# EAGLE design ESP32_Thing_Plus_UFL (EAGLE 9.6.2)
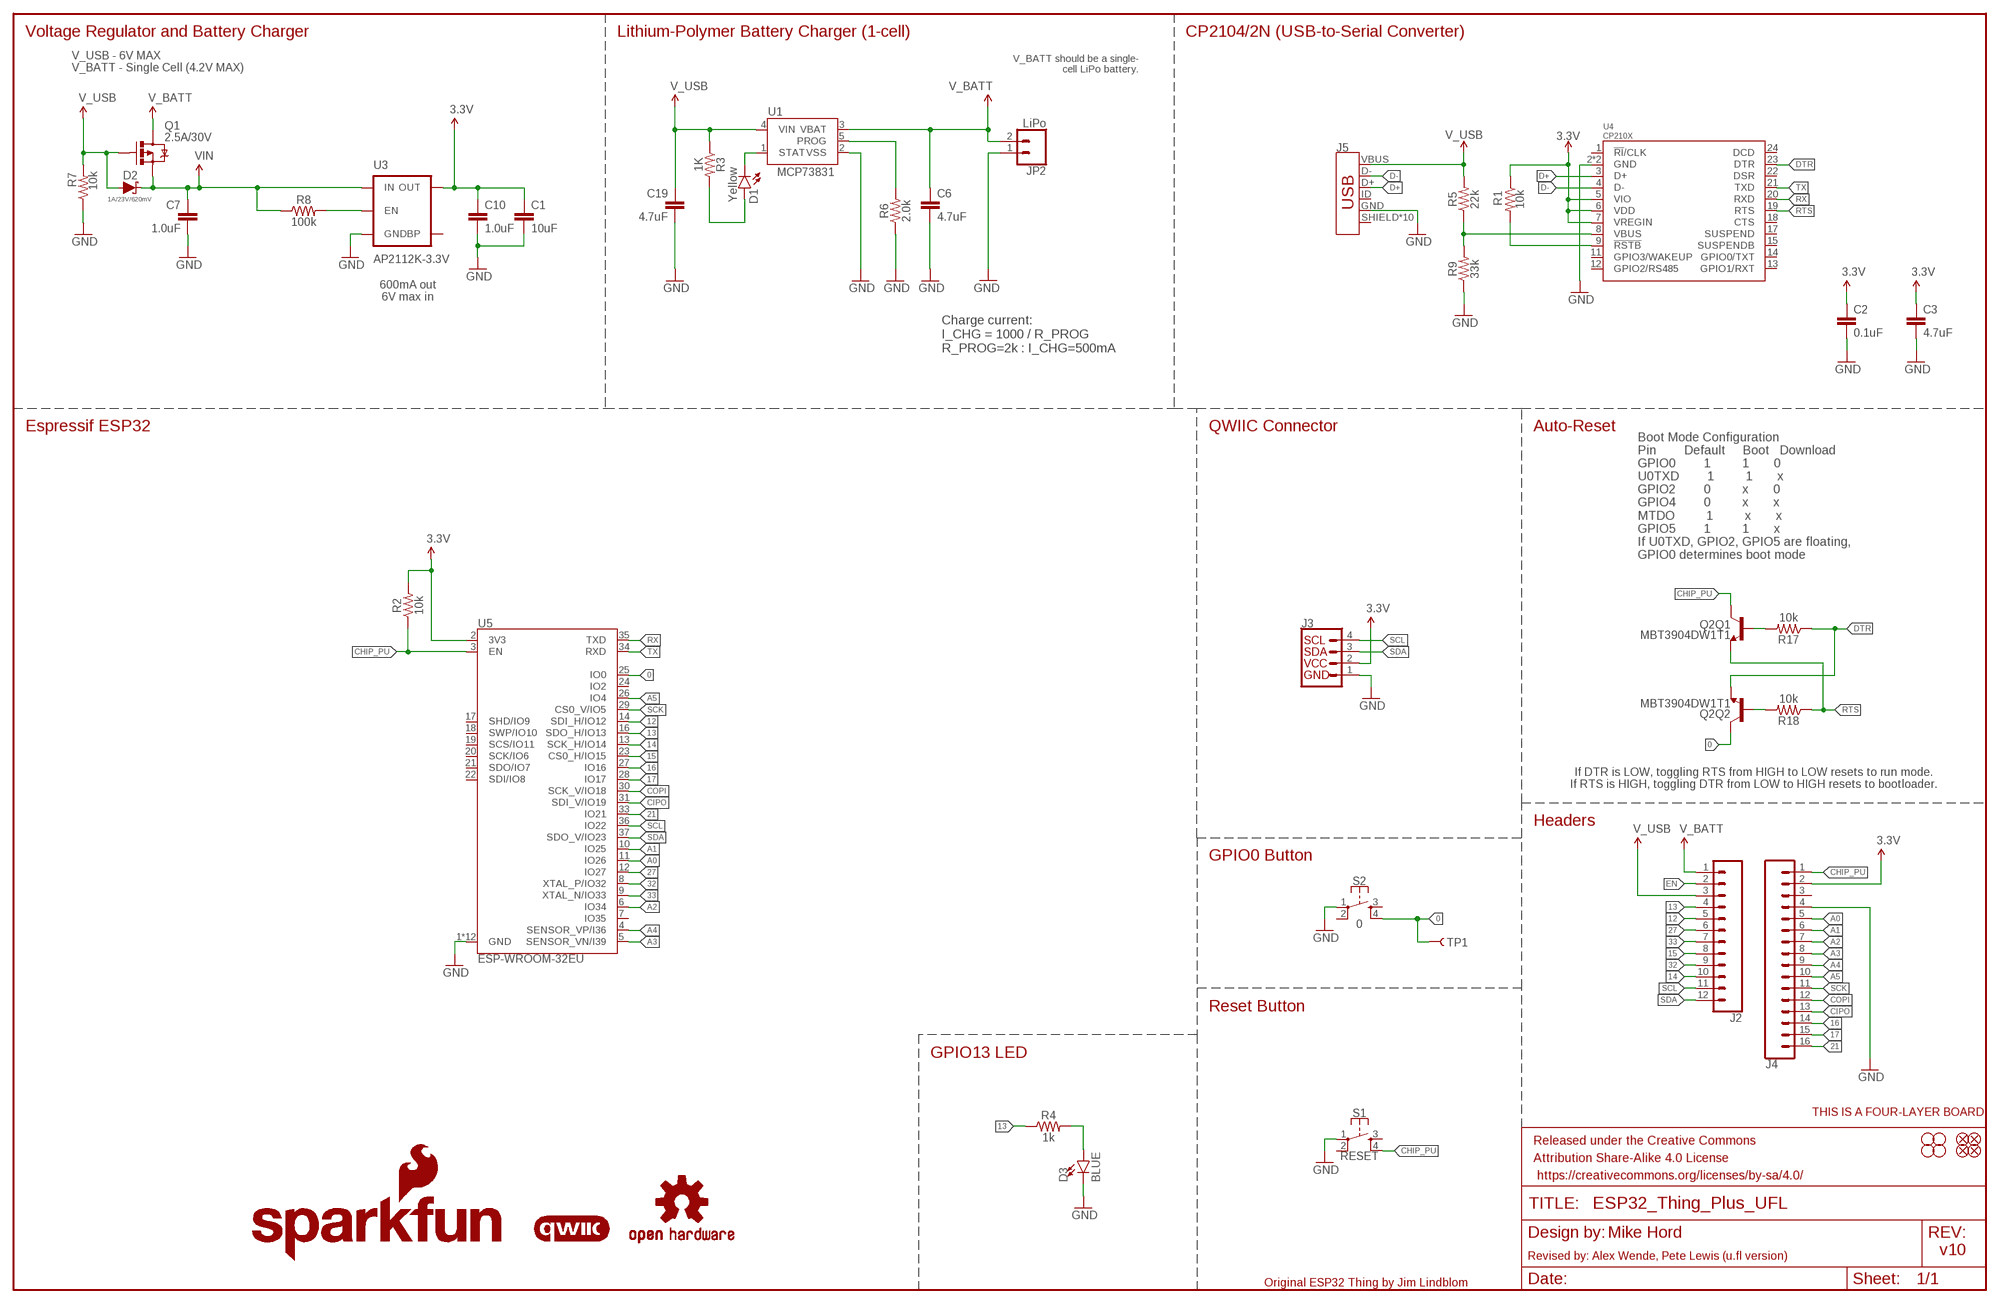
[diagram p0: schematic, sheet 1]

## Parts
C1  10uF  10UF-0603-6.3V-20%  [0603]
C2  0.1uF  0.1UF-0402T-16V-10%  [0402-TIGHT]
C3  4.7uF  4.7UF-0402_TIGHT-6.3V-20%-X5R  [0402-TIGHT]
C6  4.7uF  4.7UF-0402_TIGHT-6.3V-20%-X5R  [0402-TIGHT]
C7  1.0uF  1.0UF-0402T-16V-10%  [0402-TIGHT]
C10  1.0uF  1.0UF-0402T-16V-10%  [0402-TIGHT]
C19  4.7uF  4.7UF-0402_TIGHT-6.3V-20%-X5R  [0402-TIGHT]
D1  Yellow  LED-YELLOW0603  [LED-0603]
D2  1A/23V/620mV  DIODE-SCHOTTKY-BAT20J  [SOD-323]
D3  BLUE  LED-BLUE0603  [LED-0603]
FD1  FIDUCIALUFIDUCIAL  [FIDUCIAL-MICRO]
FD2  FIDUCIALUFIDUCIAL  [FIDUCIAL-MICRO]
FD3  FIDUCIALUFIDUCIAL  [FIDUCIAL-MICRO]
FD4  FIDUCIALUFIDUCIAL  [FIDUCIAL-MICRO]
FRAME1  FRAME-LEDGER  [CREATIVE_COMMONS]
H1  STAND-OFFTIGHT  [STAND-OFF-TIGHT]
H2  STAND-OFFTIGHT  [STAND-OFF-TIGHT]
H3  STAND-OFFTIGHT  [STAND-OFF-TIGHT]
H4  STAND-OFFTIGHT  [STAND-OFF-TIGHT]
J2  CONN_12SM_SQ_NO_SILK  [1X12_SM_SQ_NOSILK]
J3  QWIIC_CONNECTORJS-1MM  [1X04_1MM_RA]
J4  CONN_161X16_SM_SQ_NOSILK  [1X16_SM_SQ_NOSILK]
J5  USB_MICRO-B_HALF_PTH_MILL  [USB-MICROB-PTH-MILL]
JP2  LiPo  CONN_02-JST-2MM-SMT  [JST-2-SMD]
LOGO2  OSHW-LOGOMINI  [OSHW-LOGO-MINI]
LOGO3  SFE_LOGO_NAME_FLAME.1_INCH  [SFE_LOGO_NAME_FLAME_.1]
LOGO4  FOUR_LAYER_WARNING  [FOUR_LAYER_WARNING]
LOGO5  SFE_LOGO_NAME_FLAME.1_INCH  [SFE_LOGO_NAME_FLAME_.1]
LOGO6  QWIIC_LOGO_5MM  [QWIIC_5MM]
Q1  2.5A/30V  MOSFET-PCHANNELDMG2307L  [SOT23-3@1]
Q2  MBT3904DW1T1  TRANS_NPN_DUAL-MBT3904DW1T1  [SC70-6]
R1  10k  10KOHM-0603-1/10W-1%  [0603]
R2  10k  10KOHM-0603-1/10W-1%  [0603]
R3  1K  1KOHM-1/10W-1%(0603)  [0603]
R4  1k  1KOHM-0603-1/10W-1%  [0603]
R5  22k  22KOHM-0402_TIGHT-1/10W-1%  [0402-TIGHT]
R6  2.0k  2.0KOHM1/10W5%(0603)  [0603]
R7  10k  10KOHM-0603-1/10W-1%  [0603]
R8  100k  100KOHM-0402T-1/16W-1%  [0402-TIGHT]
R9  33k  33KOHM-0402T-1/16W-1%  [0402-TIGHT]
R17  10k  10KOHM-0603-1/10W-1%  [0603]
R18  10k  10KOHM-0603-1/10W-1%  [0603]
S1  RESET  MOMENTARY-SWITCH-SPST-2-SMD-4.6X2.8MM  [TACTILE_SWITCH_SMD_4.6X2.8MM]
S2  0  MOMENTARY-SWITCH-SPST-2-SMD-4.6X2.8MM  [TACTILE_SWITCH_SMD_4.6X2.8MM]
TP1  TEST-POINTTP_15TH_THRU  [TP_15TH]
U1  MCP73831  [SOT23-5]
U3  AP2112K-3.3V  V_REG_LDOSMD  [SOT23-5]
U4  CP210X  CP2102N  [QFN24]
U5  ESP-WROOM-32EU  ESP-WROOM-3232U-NARROW  [ESP-WROOM-32EU-NARROW]

## Nets
0: Q2.6(Q2:C) S2.4 TP1.P$1 U5.25(IO0)
3.3V: C1.1 C2.1 C3.1 C10.1 J3.2 J4.2 R1.1 R2.2 U3.5(OUT) U4.5(VIO) U4.6(VDD) U4.7(VREGIN) U5.2(3V3)
12: J2.5 U5.14(SDI_H/IO12)
13: J2.4 R4.1 U5.16(SDO_H/IO13)
14: J2.10 U5.13(SCK_H/IO14)
15: J2.8 U5.23(CS0_H/IO15)
16: J4.14 U5.27(IO16)
17: J4.15 U5.28(IO17)
21: J4.16 U5.33(IO21)
27: J2.6 U5.12(IO27)
32: J2.9 U5.8(XTAL_P/IO32)
33: J2.7 U5.9(XTAL_N/IO33)
A0: J4.5 U5.11(IO26)
A1: J4.6 U5.10(IO25)
A2: J4.7 U5.6(IO34)
A3: J4.8 U5.5(SENSOR_VN/I39)
A4: J4.9 U5.4(SENSOR_VP/I36)
A5: J4.10 U5.26(IO4)
CHG: D1.C U1.1(STAT)
CHIP_PU: J4.1 Q2.3(Q1:C) R2.1 S1.4 U5.3(EN)
CIPO: J4.13 U5.31(SDI_V/IO19)
COPI: J4.12 U5.30(SCK_V/IO18)
D+: J5.D+ U4.3(D+)
D-: J5.D- U4.4(D-)
DTR: Q2.1(Q2:E) R17.1 U4.23(DTR)
EN: J2.2 R8.2 U3.3(EN)
GND: C1.2 C2.2 C3.2 C6.2 C7.2 C10.2 C19.2 D3.C J3.1 J4.4 J5.GND JP2.1 R6.1 R7.1 R9.1 S1.1 S2.1 U1.2(VSS) U3.2(GND) U4.2(GND) U4.PAD(GND) U5.1(GND) U5.15(GND) U5.38(GND) U5.GND U5.P$1(GND) U5.P$2(GND) U5.P$3(GND) U5.P$4(GND) U5.P$5(GND) U5.P$6(GND) U5.P$7(GND) U5.P$8(GND)
N$1: R1.2 U4.9(!RSTB)
N$2: D3.A R4.2
N$4: R5.1 R9.2 U4.8(VBUS)
N$10: Q2.5(Q1:B) R17.2
N$12: Q2.2(Q2:B) R18.2
N$14: R6.2 U1.5(PROG)
N$17: D1.A R3.2
RTS: Q2.4(Q1:E) R18.1 U4.19(RTS)
RX: U4.20(RXD) U5.35(TXD)
SCK: J4.11 U5.29(CS0_V/IO5)
SCL: J2.11 J3.4 U5.36(IO22)
SDA: J2.12 J3.3 U5.37(SDO_V/IO23)
TX: U4.21(TXD) U5.34(RXD)
V_BATT: C6.1 J2.1 JP2.2 Q1.3(D) U1.3(VBAT)
V_USB: C19.1 D2.A J2.3 J5.VBUS Q1.1(G) R3.1 R5.2 R7.2 U1.4(VIN)
VIN: C7.1 D2.C Q1.2(S) R8.1 U3.1(IN)
Unconnected: J4.3 J5.ID J5.SHIELD J5.SHIELD2(SHIELD) J5.SHIELD3(SHIELD) J5.SHIELD4(SHIELD) J5.SHIELD5(SHIELD) J5.SHIELD6(SHIELD) J5.SHIELD7(SHIELD) J5.SHIELD8(SHIELD) J5.SHIELD9(SHIELD) J5.SHIELD10(SHIELD) S1.2 S1.3 S2.2 S2.3 U3.4(BP) U4.1(!RI!/CLK) U4.11(GPIO3/WAKEUP) U4.12(GPIO2/RS485) U4.13(GPIO1/RXT) U4.14(GPIO0/TXT) U4.15(SUSPENDB) U4.17(SUSPEND) U4.18(CTS) U4.22(DSR) U4.24(DCD) U5.7(IO35) U5.17(SHD/IO9) U5.18(SWP/IO10) U5.19(SCS/IO11) U5.20(SCK/IO6) U5.21(SDO/IO7) U5.22(SDI/IO8) U5.24(IO2)

## Notes on the sheet
- Voltage Regulator and Battery Charger | Lithium-Polymer Battery Charger (1-cell) | CP2104/2N (USB-to-Serial Converter)
- V_BATT should be a single-
  cell LiPo battery.
- V_USB - 6V MAX
  V_BATT - Single Cell (4.2V MAX)
- 600mA out
  6V max in
- Charge current:
  I_CHG = 1000 / R_PROG
  R_PROG=2k : I_CHG=500mA
- Espressif ESP32 | QWIIC Connector | Auto-Reset
- Boot Mode Configuration
  Pin        Default     Boot   Download
  GPIO0        1         1       0
  U0TXD        1         1       x
  GPIO2        0         x       0
  GPIO4        0         x       x
  MTDO         1         x       x
  GPIO5        1         1       x
  If U0TXD, GPIO2, GPIO5 are floating, 
  GPIO0 determines boot mode
- If DTR is LOW, toggling RTS from HIGH to LOW resets to run mode.
  If RTS is HIGH, toggling DTR from LOW to HIGH resets to bootloader.
- Headers
- GPIO0 Button
- Reset Button
- GPIO13 LED
- Mike Hord
- v10
- Revised by: Alex Wende, Pete Lewis (u.fl version)
- Original ESP32 Thing by Jim Lindblom

## Library data of the parts
C1 = SparkFun-Capacitors:10UF: 10.0µF ceramic capacitors A capacitor is a passive two-terminal electrical component used to store electrical energy temporarily in an electric field.; PROD_ID: CAP-11015
C2 = SparkFun-Capacitors:0.1UF: 0.1µF ceramic capacitors A capacitor is a passive two-terminal electrical component used to store electrical energy temporarily in an electric field.; PROD_ID: CAP-12416
C3 C6 C19 = SparkFun-Capacitors:4.7UF: 4.7µF ceramic capacitors A capacitor is a passive two-terminal electrical component used to store electrical energy temporarily in an electric field.; PROD_ID: CAP-14240
C7 C10 = SparkFun-Capacitors:1.0UF: 1µF ceramic capacitors A capacitor is a passive two-terminal electrical component used to store electrical energy temporarily in an electric field.; PROD_ID: CAP-12417
D1 = SparkFun-LED:LED-YELLOW: Yellow SMD LED Used in manufacturing several products at SparkFun. Packages: 0603 - SMD 0603 package[Product Link] <http://www.kingbrightusa.com/product.asp?catalog_name=LED&product_id=APT1608SYCK> 0603 -SMART - SMART SMD 0603 package (more efficient/more expensive) [Product Link] <http://www.osram-os.com/osram_os/en/products/product-catalog/led-light-emitting-diodes/smartled-0603/ly-l29k/index.jsp> LilyPad - SMD1206 package[Product Datasheet] <https://www.sparkfun.com/datasheets/DevTools/LilyPad/Q150YUS4.pdf> SparkFun Products: Blynk Board <https://www.sparkfun.com/products/13794> IOIO-OTG <https://www.sparkfun.com/products/13613> XBee Explorer Serial <https://www.sparkfun.com/products/13225>; PROD_ID: DIO-09003
D2 = SparkFun-DiscreteSemi:DIODE-SCHOTTKY: Schottky diode A Schottky diode is a semiconductor diode which has a low forward voltage drop and a very fast switching action.; PROD_ID: DIO-11623
D3 = SparkFun-LED:LED-BLUE: Blue SMD LED Used in manufacturing of various products at SparkFun Packages: 0603 - SMD 0603 package [Product Link] <http://www.digikey.com/product-detail/en/SMLE12BC7TT86/511-1589-2-ND/1641808> 1206 - SMD1206 package [Product Link] <http://www.digikey.com/product-detail/en/lite-on-inc/LTST-C150TBKT/160-1643-1-ND/573584> SparkFun Products: ESP8266 Thing-Dev Board <https://www.sparkfun.com/products/13711> RedBoard <https://www.sparkfun.com/products/12757>; PROD_ID: DIO-08575
FD1-FD4 = SparkFun-Aesthetics:FIDUCIAL: Fiducial Alignment Points Point-of-reference for pick-and-place machines and other optical instruments.
FRAME1 = SparkFun-Aesthetics:FRAME-LEDGER: Schematic Frame - Ledger Standard 11x14 US Ledger frame
H1-H4 = SparkFun-Hardware:STAND-OFF: Stand Off Drill holes for mechanically mounting via screws, standoffs, etc. Note: Use the keepout ring to avoid running the screw head into surrounding components. Variant Overviews STAND-OFF - Mechanical footprint for a #4 phillips button head screw. STAND-OFF-TIGHT - Mechanical footprint for a #4 phillips button head screw, Example SparkFun Products Screw - Phillips Head (1/4", 4-40, 10 pack) <https://www.sparkfun.com/products/10453> (PRT-10453) Screw - Phillips Head (1/2", 4-40, 10 pack) <https://www.sparkfun.com/products/10452> (PRT-10452) Screw - Phillips Head (3/4", 4-40, 10 pack) <https://www.sparkfun.com/products/10451> (PRT-10451) Screw - Phillips Head (1", 4-40, 10 pack) <https://www.sparkfun.com/products/10450> (PRT-10450)
J2 = SparkFun-Connectors:CONN_12: Multi connection point. Often used as Generic Header-pin footprint for 0.1 inch spaced/style header connections On any of the 0.1 inch spaced packages, you can populate with these: Break Away Headers - Straight <https://www.sparkfun.com/products/116> (PRT-00116) Break Away Male Headers - Right Angle <https://www.sparkfun.com/products/553> (PRT-00553) Female Headers <https://www.sparkfun.com/products/115> (PRT-00115) Break Away Headers - Machine Pin <https://www.sparkfun.com/products/117> (PRT-00117) Break Away Female Headers - Swiss Machine Pin <https://www.sparkfun.com/products/743> (PRT-00743) For SCREWTERMINALS and SPRING TERMINALS visit here: Screw Terimnals on SparkFun.com <https://www.sparkfun.com/search/results?term=Screw+Terminals> (5mm/3.5mm/2.54mm spacing) This device is also useful as a general connection point to wire up your design to another part of your project. Our various solder wires solder well into these plated through hole pads. Hook-Up Wire - Assortment (Stranded, 22 AWG) <https://www.sparkfun.com/products/11375> (PRT-11375) Hook-Up Wire - Assortment (Solid Core, 22 AWG) <https://www.sparkfun.com/products/11367> (PRT-11367) View the entire wire category on our website here <https://www.sparkfun.com/categories/141> Special notes: Molex polarized connector foot print use with SKU : PRT-08231 with associated crimp pins and housings. 1MM SMD Version SKU: PRT-10208 NOTES ON THE VARIANTS LOCK and LOCK_LONGPADS... This footprint was designed to help hold the alignment of a through-hole component (i.e. 6-pin header) while soldering it into place. You may notice that each hole has been shifted either up or down by 0.005 of an inch from it's more standard position (which is a perfectly straight line). This slight alteration caused the pins (the squares in the middle) to touch the edges of the holes. Because they are alternating, it causes a "brace" to hold the component in place. 0.005 has proven to be the perfect amount of "off-center" position when using our standard breakaway headers. Although looks a little odd when you look at the bare footprint, once you have a header in there, the alteration is very hard to notice. Also,if you push a header all the way into place, it is covered up entirely on the bottom side.
J3 = SparkFun-Connectors:QWIIC_CONNECTOR: SparkFun I2C Standard Qwiic Connector An SMD 1mm pitch JST connector makes it easy and quick (get it? Qwiic?) to connect I2C devices to each other. The Qwiic system <http://www.sparkfun.com/qwiic> enables fast and solderless connection between popular platforms and various sensors and actuators. We carry 200mm <https://www.sparkfun.com/products/14204>, 100mm <https://www.sparkfun.com/products/14205>, 50mm <https://www.sparkfun.com/products/14206>, and breadboard friendly <https://www.sparkfun.com/products/14207> Qwiic cables. We also offer 10 pcs strips <https://www.sparkfun.com/products/14323> the SMD connectors.; PROD_ID: CONN-13694
J4 = SparkFun-Connectors:CONN_16: Multi connection point. Often used as Generic Header-pin footprint for 0.1 inch spaced/style header connections On any of the 0.1 inch spaced packages, you can populate with these: Break Away Headers - Straight <https://www.sparkfun.com/products/116> (PRT-00116) Break Away Male Headers - Right Angle <https://www.sparkfun.com/products/553> (PRT-00553) Female Headers <https://www.sparkfun.com/products/115> (PRT-00115) Break Away Headers - Machine Pin <https://www.sparkfun.com/products/117> (PRT-00117) Break Away Female Headers - Swiss Machine Pin <https://www.sparkfun.com/products/743> (PRT-00743) For SCREWTERMINALS and SPRING TERMINALS visit here: Screw Terimnals on SparkFun.com <https://www.sparkfun.com/search/results?term=Screw+Terminals> (5mm/3.5mm/2.54mm spacing) This device is also useful as a general connection point to wire up your design to another part of your project. Our various solder wires solder well into these plated through hole pads. Hook-Up Wire - Assortment (Stranded, 22 AWG) <https://www.sparkfun.com/products/11375> (PRT-11375) Hook-Up Wire - Assortment (Solid Core, 22 AWG) <https://www.sparkfun.com/products/11367> (PRT-11367) View the entire wire category on our website here <https://www.sparkfun.com/categories/141> Special notes: Molex polarized connector foot print use with SKU : PRT-08231 with associated crimp pins and housings. 1MM SMD Version SKU: PRT-10208 NOTES ON THE VARIANTS LOCK and LOCK_LONGPADS... This footprint was designed to help hold the alignment of a through-hole component (i.e. 6-pin header) while soldering it into place. You may notice that each hole has been shifted either up or down by 0.005 of an inch from it's more standard position (which is a perfectly straight line). This slight alteration caused the pins (the squares in the middle) to touch the edges of the holes. Because they are alternating, it causes a "brace" to hold the component in place. 0.005 has proven to be the perfect amount of "off-center" position when using our standard breakaway headers. Although looks a little odd when you look at the bare footprint, once you have a header in there, the alteration is very hard to notice. Also,if you push a header all the way into place, it is covered up entirely on the bottom side.
J5 = SparkFun-Connectors:USB_MICRO-B: USB Type Micro-B Connector Male/female and PTH/SMT variants SparkFun Products: SparkFun microB USB Breakout <https://www.sparkfun.com/products/12035> SparkFun USB microB Plug Breakout <https://www.sparkfun.com/products/10031> SparkFun ESP8266 Thing <https://www.sparkfun.com/products/13231>; PROD_ID: CONN-13711
JP2 = SparkFun-Connectors:CONN_02: Multi connection point. Often used as Generic Header-pin footprint for 0.1 inch spaced/style header connections On any of the 0.1 inch spaced packages, you can populate with these: Break Away Headers - Straight <https://www.sparkfun.com/products/116> (PRT-00116) Break Away Male Headers - Right Angle <https://www.sparkfun.com/products/553> (PRT-00553) Female Headers <https://www.sparkfun.com/products/115> (PRT-00115) Break Away Headers - Machine Pin <https://www.sparkfun.com/products/117> (PRT-00117) Break Away Female Headers - Swiss Machine Pin <https://www.sparkfun.com/products/743> (PRT-00743) For SCREWTERMINALS and SPRING TERMINALS visit here: Screw Terimnals on SparkFun.com <https://www.sparkfun.com/search/results?term=Screw+Terminals> (5mm/3.5mm/2.54mm spacing) This device is also useful as a general connection point to wire up your design to another part of your project. Our various solder wires solder well into these plated through hole pads. Hook-Up Wire - Assortment (Stranded, 22 AWG) <https://www.sparkfun.com/products/11375> (PRT-11375) Hook-Up Wire - Assortment (Solid Core, 22 AWG) <https://www.sparkfun.com/products/11367> (PRT-11367) View the entire wire category on our website here <https://www.sparkfun.com/categories/141> Special notes: Molex polarized connector foot print use with: PRT-08233 with associated crimp pins and housings. 2.54_SCREWTERM for use with PRT-10571. 3.5mm Screw Terminal footprints for PRT-08084 5mm Screw Terminal footprints for use with PRT-08432; PROD_ID: CONN-11443
LOGO2 = SparkFun-Aesthetics:OSHW-LOGO: Open-Source Hardware (OSHW) Logo This logo indicates the piece of hardware it is found on incorporates a OSHW license and/or adheres to the definition of open source hardware found here: http://freedomdefined.org/OSHW
LOGO3 LOGO5 = SparkFun-Aesthetics:SFE_LOGO_NAME_FLAME: SparkFun Font Logo w/ Flame This is the SparkFun full logo. The logo on the schematic will always be the same size; the package variant is the height of the flame part of the logo. Default layer for the logo on the board is tSilk.
LOGO4 = SparkFun-Aesthetics:FOUR_LAYER_WARNING: Four-Layer Board Warning - tDoc Layer Warning text which will appear on both the schematic and the board file, notifying viewers that the design is a four-layer PCB.
LOGO6 = SparkFun-Aesthetics:QWIIC_LOGO: Qwiic Logos for placement on schematic and PCB. The 5.5mm silk logo is best for placing next to Qwiic connector.
Q1 = SparkFun-DiscreteSemi:MOSFET-PCHANNEL: Generic PMOSFET IRLML2244 - TRANS-11153 (SOT-23 -20V -4.3A) (1.Gate 2.Source 3.Drain) FQP27P06 - COM-10349 <http://www.sparkfun.com/products/10349> (TO-220 -60V -27A) (1.Gate 2.Source 3.Drain); PROD_ID: TRANS-11308
Q2 = SparkFun-DiscreteSemi:TRANS_NPN_DUAL: Dual NPN Transistors in Single Package The MBT3904W1 puts two general purpose 3904 NPN transistors in a single package. Datasheet <http://www.onsemi.com/pub_link/Collateral/MBT3904DW1T1-D.PDF> SparkFun Products: SparkFun ESP32 Thing <https://www.sparkfun.com/products/13907>; PROD_ID: TRANS-13337
R1 R2 R7 R17 R18 = SparkFun-Resistors:10KOHM: 10kΩ resistor A resistor is a passive two-terminal electrical component that implements electrical resistance as a circuit element. Resistors act to reduce current flow, and, at the same time, act to lower voltage levels within circuits. - Wikipedia; PROD_ID: RES-00824
R3 = SparkFun-Resistors:1KOHM-1/10W-1%(0603): RES-07856; PROD_ID: RES-07856
R4 = SparkFun-Resistors:1KOHM: 1kΩ resistor A resistor is a passive two-terminal electrical component that implements electrical resistance as a circuit element. Resistors act to reduce current flow, and, at the same time, act to lower voltage levels within circuits. - Wikipedia; PROD_ID: RES-07856
R5 = SparkFun-Resistors:22KOHM: 22kΩ resistor A resistor is a passive two-terminal electrical component that implements electrical resistance as a circuit element. Resistors act to reduce current flow, and, at the same time, act to lower voltage levels within circuits. - Wikipedia; PROD_ID: RES-14281
R6 = SparkFun-Resistors:2.0KOHM1/10W5%(0603): RES-08296; PROD_ID: RES-08296
R8 = SparkFun-Resistors:100KOHM: 100kΩ resistor A resistor is a passive two-terminal electrical component that implements electrical resistance as a circuit element. Resistors act to reduce current flow, and, at the same time, act to lower voltage levels within circuits. - Wikipedia; PROD_ID: RES-13495
R9 = SparkFun-Resistors:33KOHM: 33kΩ resistor A resistor is a passive two-terminal electrical component that implements electrical resistance as a circuit element. Resistors act to reduce current flow, and, at the same time, act to lower voltage levels within circuits. - Wikipedia; PROD_ID: RES-15128
S1 S2 = SparkFun-Switches:MOMENTARY-SWITCH-SPST-2: Momentary Switch (Pushbutton) - SPST - Two Circuits Normally-open (NO) SPST momentary switches (buttons, pushbuttons). Schematic symbol includes two switch circuits. Variants SMD-4.6MMX2.8MM - 4.60mm x 2.80mm Tactile Momentary Button Switch - Used on SparkFun SAMD21 Mini Breakout <https://www.sparkfun.com/products/13664> SMD-5.2MM - Mini Pushbutton Switch - SMD <https://www.sparkfun.com/products/8720> - Used on Arduino Pro Mini <https://www.sparkfun.com/products/11114>; PROD_ID: SWCH-13065
TP1 = SparkFun-Connectors:TEST-POINT: SparkFun Test Points Bare copper test points for troubleshooting or In-Circuit-Testing. These are used by our Production team for verifying production board runs using pogo-pins on test beds. SparkFun Products: SparkFun LSM9DS1 Breakout <https://www.sparkfun.com/products/13284> SparkFun PSOC <https://www.sparkfun.com/products/13714> SparkFun Load Cell Amplifier <https://www.sparkfun.com/products/13879>
U1 = SparkFun-PowerIC:MCP73831: Miniature single cell, fully integrated Li-Ion, Li-polymer charge management controller http://ww1.microchip.com/downloads/en/DeviceDoc/20001984g.pdf IC-09995; PROD_ID: IC-09995
U3 = SparkFun-PowerIC:V_REG_LDO: Voltage Regulator LDO Standard 150mA LDO voltage regulator in SOT-23 layout. Micrel part MIC5205. BP (by-pass) pin is used to lower output noise with 470pF cap.; PROD_ID: VREG-12457
U4 = SparkFun-IC-Comms:CP2102N; PROD_ID: IC-14020
U5 = esp-wroom-32u:ESP-WROOM-32: ESP-WROOM-32D - trace antenna (includes keepout) ESP-WROOM-32U - U.FL antenna connector Includes both "standard" footprints and "narrow" version (for use with tighter layouts).; PROD_ID: IC-15442

## Board
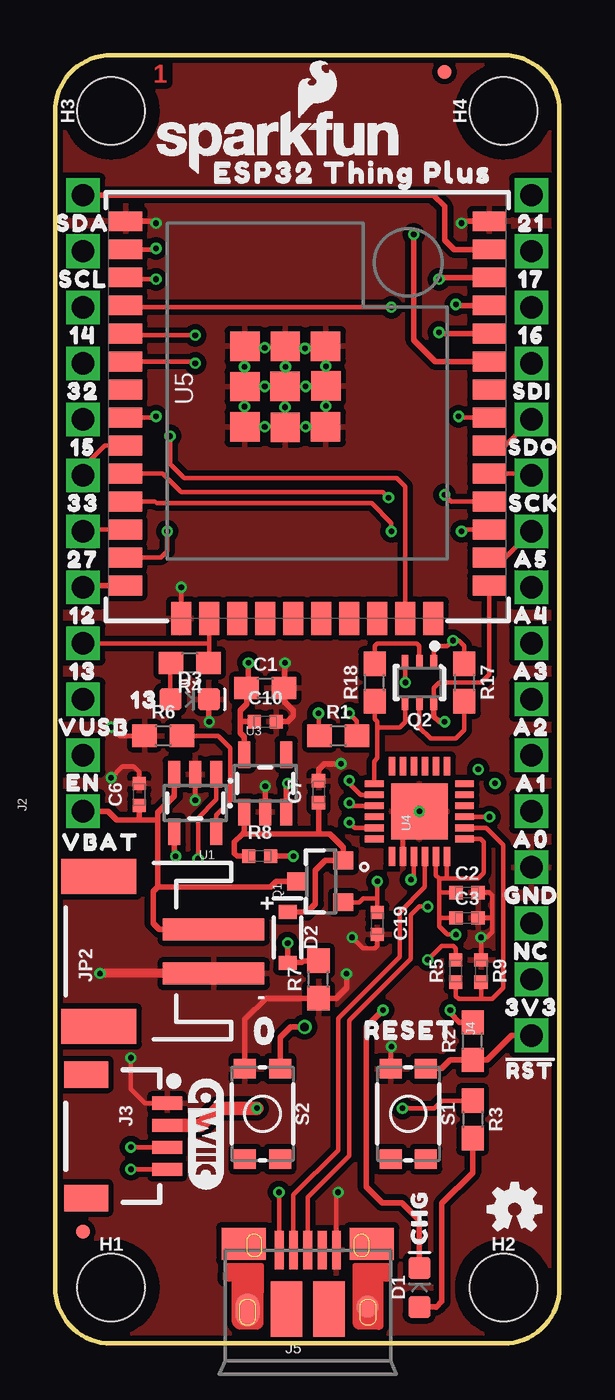
[diagram p1: board, top side]
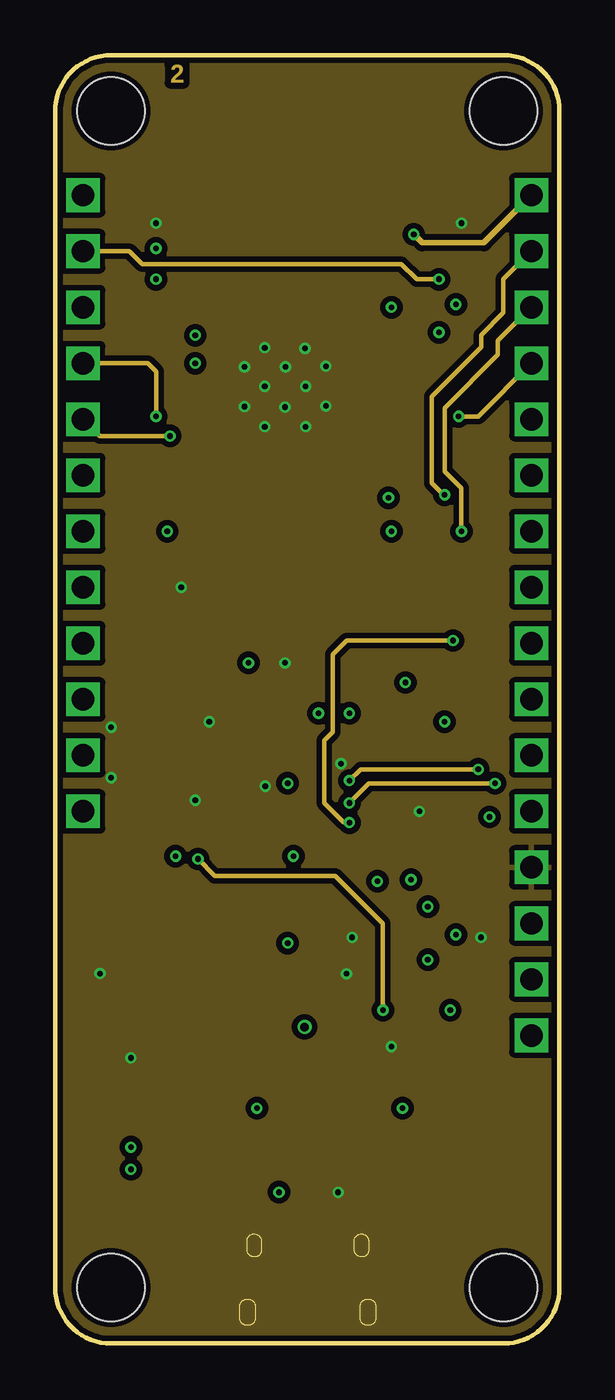
[diagram p2: board, inner layer Route2]
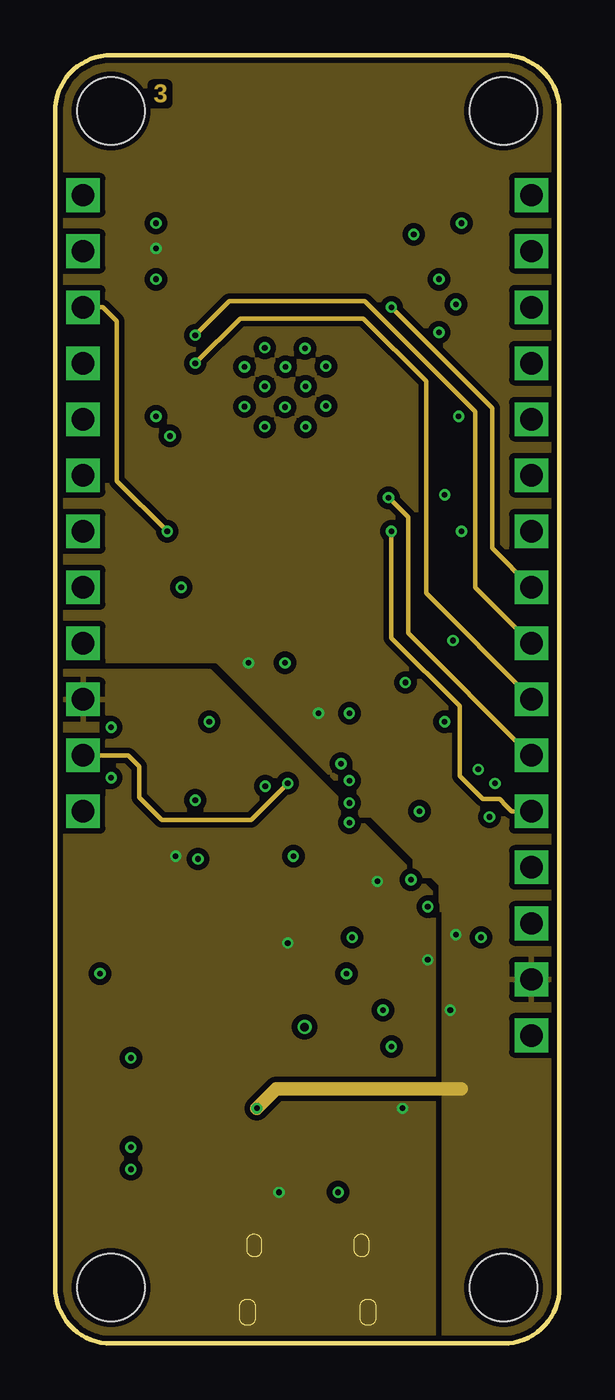
[diagram p3: board, inner layer Route15]
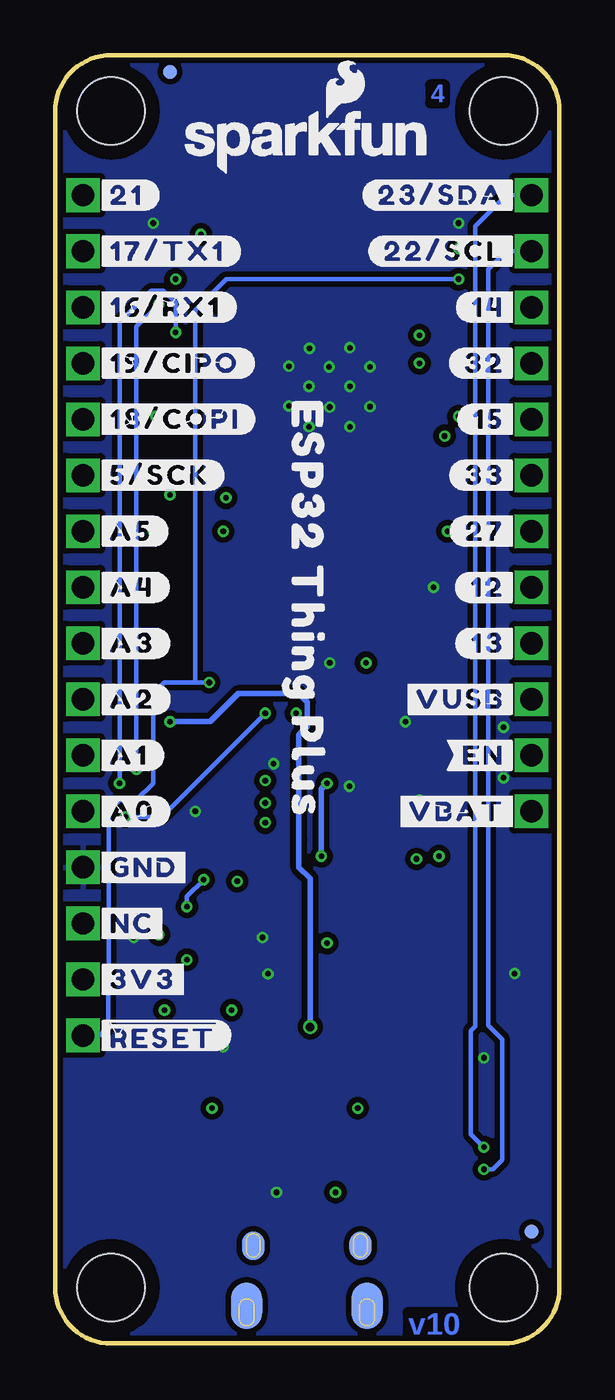
[diagram p4: board, bottom side, seen from below]

Size 22.86 x 58.42 mm. Coordinates in mm from the lower left corner, seen from the top.
Outline: 22.86,2.54 22.86,55.88 arc90 20.32,58.42 2.54,58.42 arc90 0,55.88 0,2.54 arc90 2.54,0 20.32,0 arc90 22.86,2.54
Copper layers (1*2*15*16): Top 0.035559375mm / dielectric 0.47751875mm / Route2 0.035559375mm / dielectric 0.47751875mm / Route15 0.035559375mm / dielectric 0.47751875mm / Bottom 0.035559375mm
Design rules "SparkFun-4-layer-FAB-LIMIT": minimum track width 4mil, minimum drill 6mil, track to track 5mil, track to pad 5mil, pad to pad 5mil, via to via 5mil, smd to smd 5mil, copper to edge 4mil, drill to drill 4mil, minimum pad ring 5mil, minimum via ring 5mil, stop-mask expansion 4mil, vias tented up to drill 25mil, thermal gap 10mil

### Footprints (pad centres in the part's own frame; a part is rotated, then mirrored left to right if it is on the bottom)
0603 = smd 1.1 x 1: 1 -0.85,0; 2 0.85,0
0402-TIGHT = smd 0.6 x 0.6: 1 -0.5,0; 2 0.5,0
LED-0603 = smd 1 x 1: A -0.877,0; C 0.877,0
SOD-323 = smd 0.63 x 0.83: A 1.15,0; C -1.15,0
FIDUCIAL-MICRO = smd 0.635 x 0.635: 1 0,0
STAND-OFF-TIGHT = hole 3.048: 0,0
1X12_SM_SQ_NOSILK = drill 1.016 pad 1.27 square: 1 0,0; 2 2.54,0; 3 5.08,0; 4 7.62,0; 5 10.16,0; 6 12.7,0; 7 15.24,0; 8 17.78,0; 9 20.32,0; 10 22.86,0; 11 25.4,0; 12 27.94,0
1X04_1MM_RA = smd 0.6 x 1.35: 1 -1.5,0; 2 -0.5,0; 3 0.5,0; 4 1.5,0 | smd 1.2 x 2: NC1 2.8,-3.675; NC2 -2.8,-3.675
1X16_SM_SQ_NOSILK = drill 1.016 pad 1.27 square: 1 0,0; 2 2.54,0; 3 5.08,0; 4 7.62,0; 5 10.16,0; 6 12.7,0; 7 15.24,0; 8 17.78,0; 9 20.32,0; 10 22.86,0; 11 25.4,0; 12 27.94,0; 13 30.48,0; 14 33.02,0; 15 35.56,0; 16 38.1,0
USB-MICROB-PTH-MILL = smd 0.4 x 1.75: D+ 0,0; D- -0.65,0; GND 1.3,0; ID 0.65,0; VBUS -1.3,0 | smd 2 x 1.46: SHIELD -2.9,0.275; SHIELD2 2.9,0.275 | smd 1.425 x 2.5: SHIELD3 -0.963,-2.675; SHIELD4 0.963,-2.675 | smd 1.4 x 2.1 bottom: SHIELD5 -2.731,-2.531; SHIELD7 2.729,-2.531 | smd 1 x 1: SHIELD6 2.7,-2.575 | smd 1.1 x 1.5: SHIELD8 -2.731,-2.731 | smd 1 x 1.3 bottom: SHIELD9 -2.43,0.195; SHIELD10 2.43,0.195
JST-2-SMD = smd 1 x 4.6: 1 -1,-3.7; 2 1,-3.7 | smd 1.6 x 3.4: NC1 -3.4,1.5; NC2 3.4,1.5
SOT23-3@1 = smd 0.8 x 0.9: 1 -0.95,-1; 2 0.95,-1; 3 0,1.1
SC70-6 = smd 0.3 x 0.66: 1 -0.65,-0.92; 2 0,-0.92; 3 0.65,-0.92; 4 0.65,0.92; 5 0,0.92; 6 -0.65,0.92
TACTILE_SWITCH_SMD_4.6X2.8MM = smd 0.9 x 1: 1 -2.05,-0.8; 2 2.05,-0.8; 3 2.05,0.8; 4 -2.05,0.8
TP_15TH = drill 0.381 pad 0.61: P$1 0,0
SOT23-5 = smd 0.55 x 1.2: 1 -0.95,-1.3; 2 0,-1.3; 3 0.95,-1.3; 4 0.95,1.3; 5 -0.95,1.3
QFN24 = smd 0.85 x 0.3: 1 -2.05,1.25; 2 -2.05,0.75; 3 -2.05,0.25; 4 -2.05,-0.25; 5 -2.05,-0.75; 6 -2.05,-1.25; 13 2.05,-1.25; 14 2.05,-0.75; 15 2.05,-0.25; 16 2.05,0.25; 17 2.05,0.75; 18 2.05,1.25 | smd 0.3 x 0.85: 7 -1.25,-2.05; 8 -0.75,-2.05; 9 -0.25,-2.05; 10 0.25,-2.05; 11 0.75,-2.05; 12 1.25,-2.05; 19 1.25,2.05; 20 0.75,2.05; 21 0.25,2.05; 22 -0.25,2.05; 23 -0.75,2.05; 24 -1.25,2.05 | smd 2.55 x 2.55: PAD 0,0
ESP-WROOM-32EU-NARROW = smd 0.9 x 1.5: 1 6.43,8.238; 2 5.16,8.238; 3 3.89,8.238; 4 2.62,8.238; 5 1.35,8.238; 6 0.08,8.238; 7 -1.19,8.238; 8 -2.46,8.238; 9 -3.73,8.238; 10 -5,8.238; 11 -6.27,8.238; 12 -7.54,8.238; 13 -8.81,8.238; 14 -10.08,8.238; 25 -10.08,-8.238; 26 -8.81,-8.238; 27 -7.54,-8.238; 28 -6.27,-8.238; 29 -5,-8.238; 30 -3.73,-8.238; 31 -2.46,-8.238; 32 -1.19,-8.238; 33 0.08,-8.238; 34 1.35,-8.238; 35 2.62,-8.238; 36 3.89,-8.238; 37 5.16,-8.238; 38 6.43,-8.238 | smd 1.5 x 0.9: 15 -11.57,5.715; 16 -11.57,4.445; 17 -11.57,3.175; 18 -11.57,1.905; 19 -11.57,0.635; 20 -11.57,-0.635; 21 -11.57,-1.905; 22 -11.57,-3.175; 23 -11.57,-4.445; 24 -11.57,-5.715 | smd 1.33 x 1.33: GND -1.051,1.015; P$1 0.77,-0.83; P$2 0.77,1; P$3 0.77,2.83; P$4 -1.06,2.83; P$5 -1.03,-0.84; P$6 -2.89,-0.83; P$7 -2.9,1; P$8 -2.89,2.83

### Placement (x,y rotation side)
C1  9.53,29.72 0 top
C2  18.67,20.45 0 top
C3  18.67,19.3 0 top
C6  3.81,24.89 90 top
C7  11.94,25.02 90 top
C10  9.53,28.19 0 top
C19  14.61,19.05 270 top
D1  16.51,2.54 90 top
D2  10.54,18.41 270 top
D3  6.1,29.21 0 top
FD1  17.65,57.66 0 top
FD2  17.65,57.66 0 bottom
FD3  1.27,5.08 0 top
FD4  1.27,5.08 0 bottom
FRAME1  -17.14,-19.05 0 top  (outside the outline)
H1  2.54,2.54 0 top
H2  20.32,2.54 0 top
H3  2.54,55.88 90 top
H4  20.32,55.88 90 top
J2  1.27,24.13 90 top
J3  5.08,9.4 270 top
J4  21.59,13.97 90 top
J5  11.45,4.24 0 top
JP2  3.48,17.78 90 top
LOGO2  20.83,6.1 0 top
LOGO3  11.43,54.48 0 bottom
LOGO4  30.48,39.37 0 top  (outside the outline)
LOGO5  10.16,54.48 0 top
LOGO6  6.86,9.53 270 top
Q1  12.06,20.95 90 top
Q2  16.51,29.97 180 top
R1  12.83,27.56 0 top
R2  18.92,13.72 90 top
R3  18.92,10.16 270 top
R4  6.1,30.86 180 top
R5  18.16,16.89 90 top
R6  4.9,27.56 0 top
R7  11.94,16.51 90 top
R8  9.27,22.1 0 top
R9  19.3,16.89 270 top
R17  18.54,29.97 270 top
R18  14.48,29.97 90 top
S1  16,10.41 270 top
S2  9.4,10.41 270 top
TP1  11.3,14.35 0 top
U1  6.35,24.51 180 top
U3  9.53,25.4 0 top
U4  16.51,24.13 90 top
U5  11.43,44.45 90 top
U$1  [ESP32_THING_PLUS_0]  11.43,33.02 270 bottom
U$2  [SDI0]  21.62,43.18 0 top
U$3  [#21#0]  21.08,52.07 0 bottom
U$4  [#17#TX1#0]  21.08,49.53 0 bottom
U$5  [#16#RX1#0]  21.08,46.99 0 bottom
U$6  [SDO0]  21.69,40.64 0 top
U$7  [#RST#0]  21.54,12.47 0 top
U$8  [#19#CIPO#0]  21.08,44.45 0 bottom
U$10  [#18#COPI#0]  21.08,41.91 0 bottom
U$11  [#5#SCK#0]  21.08,39.37 0 bottom
U$12  [#A5#0]  21.08,36.83 0 bottom
U$19  [#A4#0]  21.08,34.29 0 bottom
U$21  [#A3#0]  21.08,31.75 0 bottom
U$22  [#A2#0]  21.08,29.21 0 bottom
U$24  [ESP32_THING_PLUS0]  6.48,53.09 0 top
U$25  [SDA0]  1.27,50.8 0 top
U$26  [SCL0]  1.27,48.26 0 top
U$27  [#A1#0]  21.08,26.67 0 bottom
U$28  [#A0#0]  21.08,24.13 0 bottom
U$31  [#23#SDA#0]  1.78,52.07 0 bottom
U$32  [#GND#0]  21.08,21.59 0 bottom
U$33  [#22#SCL#0]  1.78,49.53 0 bottom
U$34  [#14#0]  1.78,46.99 0 bottom
U$35  [#32#0]  1.78,44.45 0 bottom
U$36  [#15#0]  1.78,41.91 0 bottom
U$37  [#33#0]  1.78,39.37 0 bottom
U$38  [#27#0]  1.78,36.83 0 bottom
U$39  [#12#0]  1.78,34.29 0 bottom
U$40  [#13#0]  1.78,31.75 0 bottom
U$41  [#VUSB#0]  1.78,29.21 0 bottom
U$42  [#VBAT#0]  1.78,24.13 0 bottom
U$43  [#EN#0]  1.78,26.67 0 bottom
U$44  [#NC#0]  21.08,19.05 0 bottom
U$45  [#3V3#0]  21.08,16.51 0 bottom
U$46  [##RESET##0]  21.08,13.97 0 bottom
U$58  [140]  1.27,45.72 0 top
U$59  [ORDERING_INSTRUCTIONS]  29.21,50.8 0 top  (outside the outline)
U$68  [320]  1.27,43.18 0 top
U$69  [150]  1.27,40.64 0 top
U$70  [330]  1.27,38.1 0 top
U$71  [270]  1.27,35.56 0 top
U$72  [120]  1.27,33.02 0 top
U$73  [130]  1.27,30.48 0 top
U$74  [130]  4.04,29.18 0 top
U$75  [VUSB0]  1.75,27.94 0 top
U$76  [EN0]  1.27,25.43 0 top
U$77  [VBAT0]  2.06,22.73 0 top
U$78  [CHG0]  16.51,5.71 90 top
U$79  [RESET0]  16.1,14.2 0 top
U$81  [3V30]  21.59,15.24 0 top
U$82  [NC0]  21.59,17.78 0 top
U$83  [GND0]  21.59,20.32 0 top
U$84  [A00]  21.59,22.86 0 top
U$85  [A10]  21.59,25.4 0 top
U$86  [A20]  21.59,27.94 0 top
U$87  [A30]  21.59,30.48 0 top
U$88  [A40]  21.59,33.02 0 top
U$89  [A50]  21.59,35.56 0 top
U$90  [SCK0]  21.69,38.1 0 top
U$93  [160]  21.59,45.72 0 top
U$94  [170]  21.59,48.26 0 top
U$95  [210]  21.59,50.8 0 top
U$96  [00]  9.55,14.15 0 top

### Tracks (layer width: path | path; a pad name or v marks a point on that pad's centre or on a via)
0  (via drill 0.25)
  Top 0.203: U5.25 19.67,30.34 19.3,29.97 17.4,29.97 17.16,29.73 Q2.6
  Top 0.254: S2.4 10.2,13.88 10.67,14.35 TP1.P$1 | v17.65,28.19 17.4,28.19 17.16,28.43 Q2.6
  Bottom 0.254: v17.65,28.19 15.83,28.19 14.56,29.46 11.81,29.46 11.43,29.08 11.43,27.98 11.81,27.6 11.81,22.86 11.81,21.59 11.3,21.08 TP1.P$1
3.3V  (via drill 0.25)
  Top 0.203: U4.5 17.26,21.22 17.4,21.08 | U4.6 17.76,21.1 17.78,21.08 | U5.2 4.53,49.61 v4.57,49.66 | U4.7 19.28,22.88 19.43,22.73 19.43,21.34 19.18,21.08 17.78,21.08 | C2.1 17.4,20.45 | 17.78,21.08 17.4,21.08 | R1.1 11.94,27.6 v11.94,28.57 | v18.16,18.54 17.78,18.54 17.4,18.92 17.4,19.3 | 17.4,19.3 17.4,20.45 | 17.4,20.45 17.4,21.08 | C3.1 17.4,19.3
  Top 0.254: R2.2 18.33,14.57 17.91,14.99 v17.91,15.11 | 8.38,28.19 8.38,28.7 8.68,29 C1.1 8.76,29.81 v8.76,30.86 | 8.38,28.19 8.38,27.69 8.57,27.49 U3.5 | C10.1 8.38,28.19
  Top 0.61: J3.2 6.6,9.9 7.37,10.67 v9.14,10.67
  Route15 0.61: v9.14,10.67 10.03,11.56 18.41,11.56
  pour Route15 (isolate 0.254, rank 2): 0,58.42 22.86,58.42 22.86,0 0,0
12
  Top 0.254: U5.14 1.35,34.37 J2.5
13
  Top 0.203: U5.16 6.99,31.75 | 6.99,31.75 6.99,30.9 R4.1 | J2.4 6.99,31.75
14  (via drill 0.25)
  Top 0.203: U5.13 4.78,35.64 5.08,35.94 v5.08,36.83
  Route15 0.203: v5.08,36.83 2.79,39.12 2.79,46.35 2.16,46.99 J2.10
15  (via drill 0.25)
  Top 0.203: U5.23 15.88,38.86 15.49,39.24 5.84,39.24 5.21,39.88 v5.21,41.15
  Route2 0.203: v5.21,41.15 2.03,41.15 J2.8
16  (via drill 0.25)
  Top 0.203: U5.27 18.5,36.91 v18.41,36.83
  Route2 0.203: v18.41,36.83 18.41,38.78 17.65,39.54 17.65,42.42 20.07,44.83 20.07,45.47 J4.14
17  (via drill 0.25)
  Top 0.203: U5.28 17.95,38.18 v17.65,38.48
  Route2 0.203: J4.15 20.32,48.26 20.32,46.74 19.3,45.72 19.3,45.17 17.07,42.94 17.07,39.02 17.61,38.48 v17.65,38.48
21  (via drill 0.25)
  Top 0.254: v16.26,50.29 16.26,45.5 17.23,44.53 U5.33
  Route2 0.254: J4.16 20.32,50.8 19.43,49.91 16.64,49.91 v16.26,50.29
27
  Top 0.203: U5.12 1.35,36.91 J2.6
32  (via drill 0.25)
  Top 0.203: U5.8 4.53,41.99 v4.57,42.04
  Route2 0.203: v4.57,42.04 4.57,44.07 4.19,44.45 J2.9
33
  Top 0.203: U5.9 2.24,40.72 1.27,39.75 J2.7
A0  (via drill 0.25)
  Top 0.203: U5.11 4.53,38.18 4.61,38.1 14.35,38.1 15.24,37.21 v15.24,36.83
  Route15 0.203: v15.24,36.83 15.24,32 18.34,28.9 18.34,25.73 19.38,24.69 20.14,24.69 20.45,24.38 20.7,24.13 J4.5
A1  (via drill 0.25)
  Top 0.203: U5.10 4.87,39.45 5.71,38.61 14.86,38.61 v15.11,38.35
  Route15 0.203: J4.6 21.55,26.67 16,32.21 16,37.47 v15.11,38.35
A2  (via drill 0.25)
  Top 0.203: U5.6 6.27,44.53 v6.35,44.45
  Route15 0.203: v6.35,44.45 8.38,46.48 13.97,46.48 16.82,43.64 16.82,34.03 21.59,29.25 J4.7
A3  (via drill 0.25)
  Top 0.203: U5.5 3.27,45.72 v6.35,45.72
  Route15 0.203: v6.35,45.72 7.9,47.27 14.03,47.27 19.05,42.25 19.05,34.29 J4.8
A4  (via drill 0.25)
  Top 0.203: U5.4 3.27,46.99 v15.24,46.99
  Route15 0.203: v15.24,46.99 19.81,42.42 19.81,36.07 J4.9
A5
  Top 0.203: U5.26 20.4,35.64 J4.10
CHG  (via drill 0.25)
  Top 0.203: U1.1 7.3,24.66 6.48,23.84 v6.48,21.97
  Top 0.254: v14.86,15.11 14.1,14.35 14.1,7.11 14.82,6.39 15.71,6.39 16.51,5.59 D1.C
  Route2 0.203: v6.48,21.97 7.24,21.21 12.7,21.21 14.86,19.05 v14.86,15.11
CHIP_PU  (via drill 0.25)
  Top 0.203: v15.88,29.97 15.86,29.99 Q2.3 | v4.57,48.26 3.27,48.26 U5.3
  Top 0.254: S1.4 16.8,12.48 17.53,12.48 17.91,12.87 R2.1 19.6,12.87 20.7,13.97 J4.1
  Bottom 0.203: v15.88,29.97 16.51,29.97 | 16.51,29.97 17.91,29.97 18.41,29.46 18.41,25.4 19.18,24.64 19.94,24.64 20.42,24.16 20.42,16.03 20.45,16 20.45,14.35 20.83,13.97 J4.1 | v4.57,48.26 15.11,48.26 16.51,46.86 16.51,29.97
CIPO  (via drill 0.25)
  Top 0.203: U5.31 18.34,41.99 v18.29,42.04
  Route2 0.203: v18.29,42.04 19.18,42.04 J4.13
COPI
  Top 0.203: U5.30 20.4,40.72 J4.12
D+  (via drill 0.25)
  Top 0.203: v16.89,19.81 16.51,19.81 16.13,19.43 16.13,17.44 13.34,14.65 13.34,8.51 11.45,6.62 J5.D+ | v16.13,21.03 16.26,21.16 U4.3
  Bottom 0.203: v16.89,19.81 16.89,20.27 v16.13,21.03
D-
  Top 0.203: J5.D- 10.8,6.74 12.83,8.76 12.83,14.73 15.62,17.53 15.62,19.56 16.76,20.7 U4.4
DTR  (via drill 0.25)
  Top 0.203: R17.1 18.54,31.62 18.29,31.88 v18.03,31.88 17.78,31.62 17.4,31.62 17.16,31.38 Q2.1 | U4.23 13.58,23.38 v13.34,23.62
  Route2 0.203: v18.03,31.88 13.21,31.88 12.57,31.24 12.57,27.94 12.57,27.73 12.19,27.35 12.19,24.51 13.08,23.62 v13.34,23.62
EN  (via drill 0.25)
  Top 0.254: R8.2 v10.79,22.1 | U3.3 10.47,25.33 v10.54,25.4
  Route15 0.203: J2.2 3.3,26.67 3.81,26.16 3.81,24.77 4.83,23.75 8.89,23.75 v10.54,25.4
  Bottom 0.254: v10.79,22.1 10.79,25.15 v10.54,25.4
GND  (via drill 0.25)
  Top 0.203: U1.2 v6.35,24.64 | U5.15 v5.71,34.29 | R6.1 2.92,27.56 v2.54,27.94 | U4.2 15.76,23.38 U4.PAD | J3.1 4.09,10.9 3.43,11.56 v3.43,12.95 | S1.1 15.2,13.46 v15.24,13.46 | v12.83,6.86 12.75,6.78 J5.GND | 19.81,19.3 19.81,18.67 19.56,18.41 v19.3,18.41 R9.1 | 19.81,19.3 19.81,20.32 19.68,20.45 C2.2 | C3.2 19.81,19.3 | C19.2 14.61,18.03 14.48,17.91 13.97,17.91 v13.46,18.41 | C6.2 3.81,25.91 3.56,26.16 3.05,26.16 v2.54,25.65
  Top 0.254: U5.1 4.49,50.88 v4.57,50.8 | U3.2 v9.53,25.27 | D3.C 6.97,28.21 v6.99,28.19 | S2.1 8.6,14.69 9.56,15.66 R7.1 12.74,15.66 13.21,16.13 v13.21,16.76 | U5.38 18.5,50.88 v18.41,50.8 | v10.41,30.86 10.41,29.76 | 10.41,29.76 C1.2 | C10.2 10.54,28.19 10.79,28.45 10.79,28.7 10.41,29.08 10.41,29.76 | C7.2 11.94,26.04 12.19,26.29 v12.95,26.29
  Top 0.406: JP2.1 v2.03,16.78
  other vias: 16.51,24.13 8.59,44.29 11.35,43.4 11.35,41.57 9.5,41.57 8.59,42.48 10.41,42.46 12.27,42.51 11.33,45.13 9.5,45.15 9.5,43.4 10.44,44.29 12.27,44.31
  pour Route2 (isolate 0.254): 0,58.42 22.86,58.42 22.86,0 0,0
  pour Top (isolate 0.254): 0,0 0,58.42 22.86,58.42 22.86,0
  pour Bottom (isolate 0.254): 0,0 22.86,0 22.86,58.42 0,58.42
N$1  (via drill 0.25)
  Top 0.203: v19.68,23.88 U4.9 | v13.34,28.57 13.68,28.23 R1.2
  Bottom 0.203: v13.34,28.57 18.03,23.88 v19.68,23.88
N$2
  Top 0.203: D3.A 5.22,30.83 R4.2
N$4
  Top 0.203: U4.8 19.55,23.38 20.32,22.61 20.32,16.13 19.81,15.62 19.3,15.62 | 19.3,15.62 18.29,15.62 18.16,15.75 R5.1 | R9.2 19.3,15.62
N$10
  Top 0.203: Q2.5 16.51,27.94 17.02,27.43 17.53,27.43 18.16,27.43 18.54,27.81 R17.2
N$12
  Top 0.203: Q2.2 16.51,31.62 16.38,31.75 14.61,31.75 14.48,31.62 R18.2
N$14
  Top 0.203: U1.5 7.3,23.98 7.93,24.61 7.93,27.01 7.38,27.56 R6.2
N$17
  Top 0.254: R3.2 18.92,7.75 17.53,6.35 17.53,1.91 17.27,1.65 17.26,1.66 D1.A
RTS
  Top 0.203: U4.19 14.46,26.4 14.61,26.54 14.61,27.94 | 14.61,27.94 14.61,28.19 14.48,28.32 R18.1 | Q2.4 15.86,28.18 15.62,27.94 14.61,27.94
RX  (via drill 0.25)
  Top 0.203: U4.20 13.86,24.88 13.34,25.4 v13.34,25.53
  Top 0.254: U5.35 18.21,47.07 v18.16,47.12
  Route2 0.203: v19.18,26.04 13.84,26.04 v13.34,25.53
  Bottom 0.203: v19.18,26.04 19.18,46.1 v18.16,47.12
SCK
  Top 0.203: U5.29 21.51,39.45 J4.11
SCL  (via drill 0.25)
  Top 0.203: J3.4 v3.43,7.9
  Top 0.254: U5.36 17.48,48.34 v17.4,48.26
  Route2 0.203: J2.11 3.35,49.53 3.94,48.95 15.7,48.95 16.38,48.26 v17.4,48.26
  Bottom 0.203: J2.11 2.41,49.53 3.23,48.72 3.23,14.43 2.59,13.79 2.59,8.33 3.02,7.9 v3.43,7.9
SDA  (via drill 0.25)
  Top 0.203: J3.3 v3.43,8.9
  Top 0.254: J2.12 17.14,52.07 17.65,51.56 17.65,50.04 18.08,49.61 U5.37
  Bottom 0.203: J2.12 2.41,52.07 3.81,50.67 3.81,14.38 4.01,14.17 4.01,9.48 v3.43,8.9
TX  (via drill 0.25)
  Top 0.203: U4.21 13.47,24.38 v13.34,24.51
  Top 0.254: v17.4,45.85 17.45,45.8 U5.34
  Route2 0.203: v19.94,25.4 14.22,25.4 v13.34,24.51
  Bottom 0.203: v17.4,45.85 17.4,47.2 17.95,47.75 18.5,47.75 19.94,46.31 v19.94,25.4
V_BATT
  Top 0.254: Q1.3 10.03,20.95 9.78,20.7 4.64,20.7 | JP2.2 4.71,18.78 4.45,19.05 4.45,20.5 4.64,20.7 | U1.3 5.4,24.83 4.64,24.07 4.64,23.75 | 4.64,23.75 4.64,20.7 | C6.1 3.81,23.75 | 3.81,23.75 4.64,23.75 | J2.1 2.41,24.13 2.79,23.75 3.81,23.75
V_USB  (via drill 0.25)
  Top 0.203: v15.75,10.67 17.18,10.67 17.53,11.01 R3.1 | J5.VBUS v10.15,6.86 | R5.2 18.16,17.91 18.03,18.03 17.53,18.03 v16.89,17.4 | C19.1 14.61,20.19 | 14.61,20.19 v14.61,20.95 | Q1.1 13.78,20 13.97,20.19 14.61,20.19
  Top 0.254: U1.4 5.4,22.16 v5.46,22.1 | R7.2 11.26,17.36 11.18,17.27 D2.A v10.54,18.16
  pour Route15 (isolate 0.254): 17.14,0 17.14,20.32 6.99,30.48 0,30.48 0,0
VIN
  Top 0.254: D2.C 11.42,19.57 11.8,19.94 11.8,21.45 12.25,21.91 Q1.2 13.06,22.5 12.45,23.11 11.94,23.11 | C7.1 11.94,23.11 | 8.51,23.11 11.94,23.11 | R8.1 8.26,22.1 8.13,22.23 8.13,22.73 8.51,23.11 | U3.1 8.57,23.18 8.51,23.11

### Text on the board
Top: 1
Route2: 2
Route15: 3
Bottom: 4 | v10
tPlace: + | -
tDocu: Mike Hord | Revised by: Alex Wende | Revised by: Pete Lewis (u.fl)